# EAGLE schematic fire-fly (EAGLE 7.0.0)
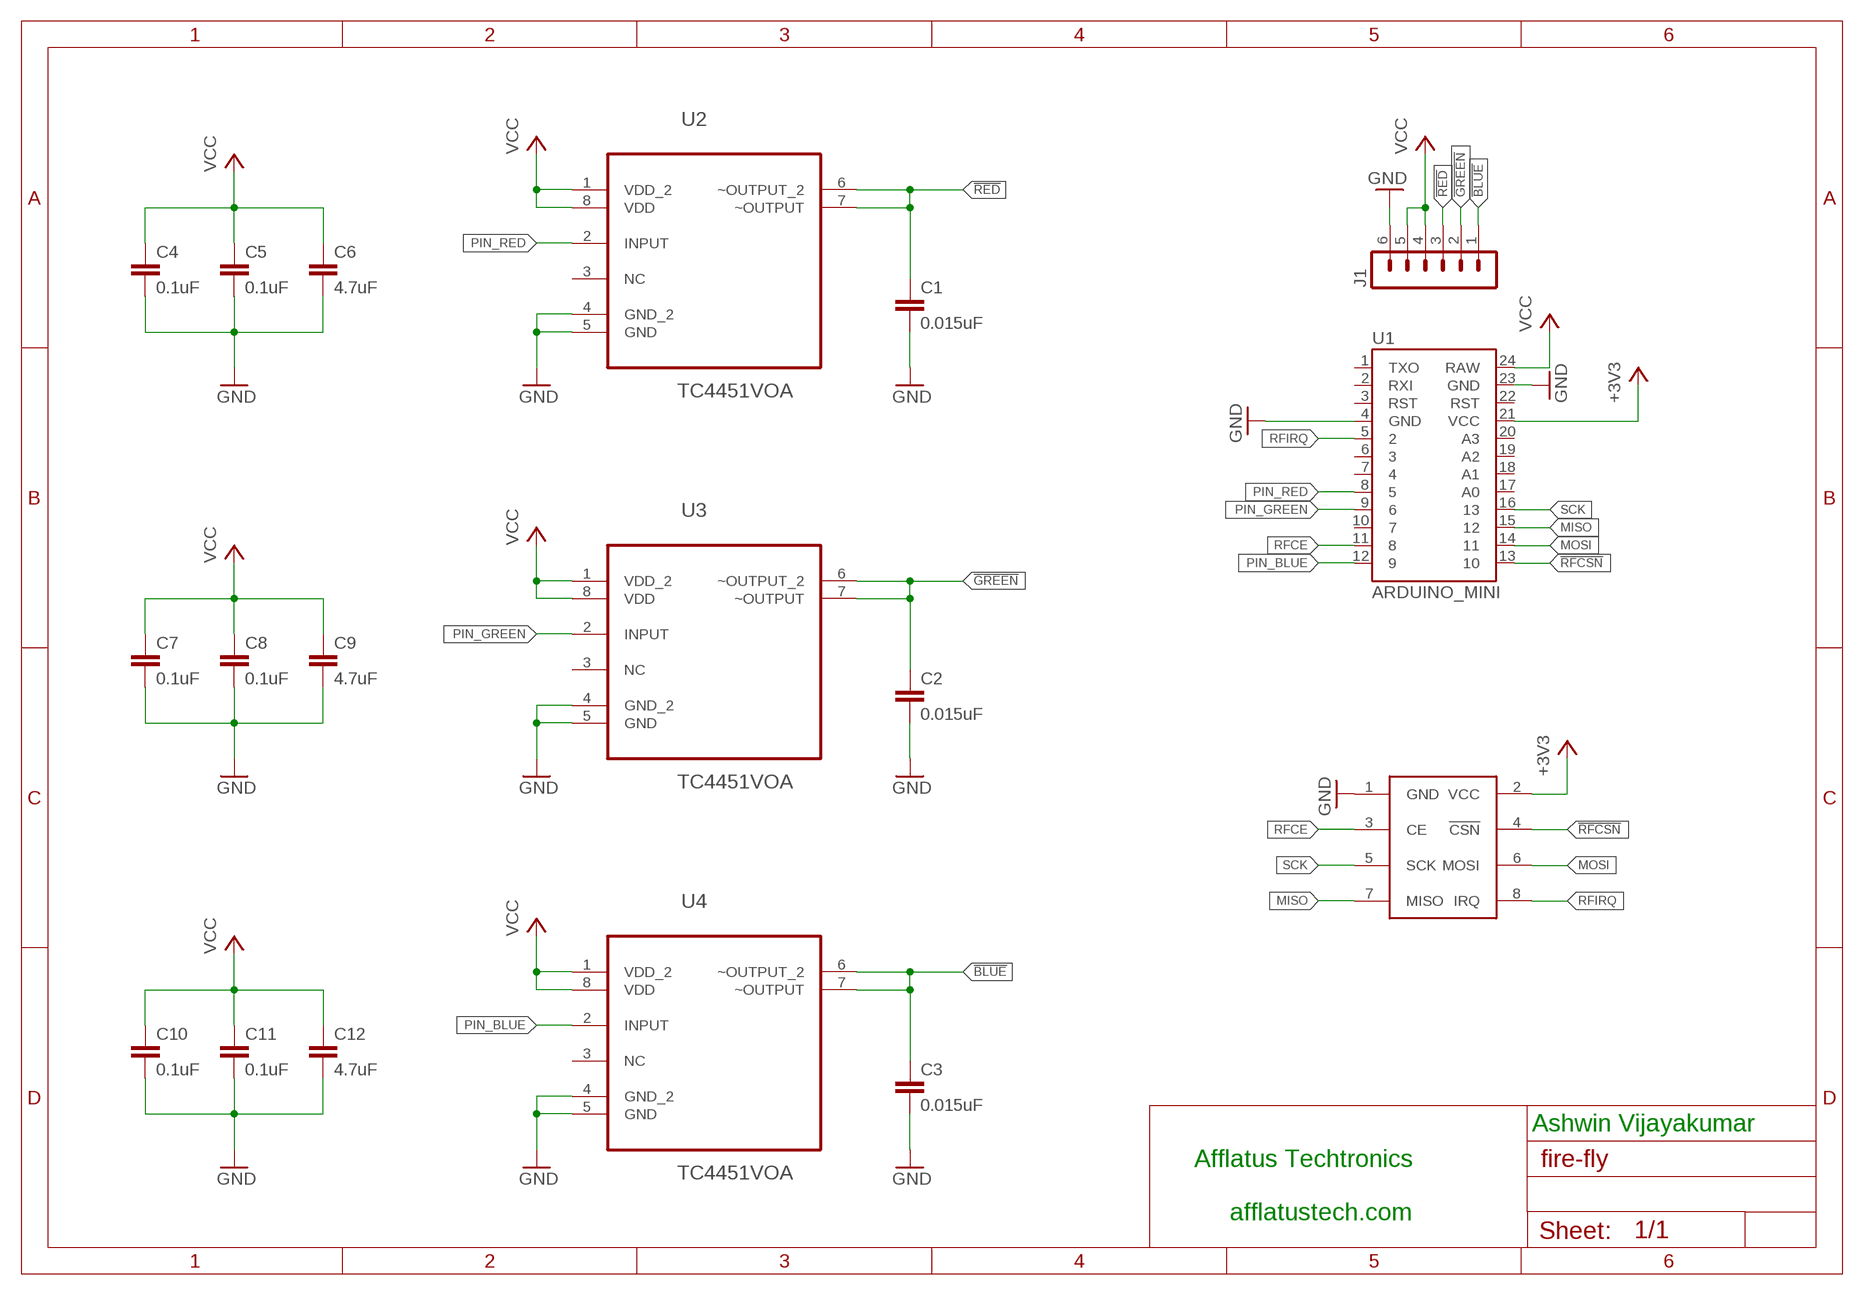
[diagram p0: schematic, sheet 1]

## Parts
C1  0.015uF  C-EUC1206  [C1206]
C2  0.015uF  C-EUC1206  [C1206]
C3  0.015uF  C-EUC1206  [C1206]
C4  0.1uF  C-EUC1206  [C1206]
C5  0.1uF  C-EUC1206  [C1206]
C6  4.7uF  C-EUC1206  [C1206]
C7  0.1uF  C-EUC1206  [C1206]
C8  0.1uF  C-EUC1206  [C1206]
C9  4.7uF  C-EUC1206  [C1206]
C10  0.1uF  C-EUC1206  [C1206]
C11  0.1uF  C-EUC1206  [C1206]
C12  4.7uF  C-EUC1206  [C1206]
J1  MA06-1  [MA06-1]
U1  ARDUINO_MINI  [ARDUINO_MINI]
U2  TC4451VOA  [SOIC127P600X175-8N]
U3  TC4451VOA  [SOIC127P600X175-8N]
U4  TC4451VOA  [SOIC127P600X175-8N]
U$1  NRF24L01_MODULE  [NRF24L01_MODULE]

## Nets
!BLUE: C3.1 J1.1 U4.6(~OUTPUT_2) U4.7(~OUTPUT)
!GREEN: C2.1 J1.2 U3.6(~OUTPUT_2) U3.7(~OUTPUT)
!RED: C1.1 J1.3 U2.6(~OUTPUT_2) U2.7(~OUTPUT)
!RFCSN: U1.13 U$1.4(!CSN)
+3V3: U1.21(VCC) U$1.2(VCC)
GND: C1.2 C2.2 C3.2 C4.2 C5.2 C6.2 C7.2 C8.2 C9.2 C10.2 C11.2 C12.2 J1.6 U1.4(GND) U1.23(GND) U2.4(GND_2) U2.5(GND) U3.4(GND_2) U3.5(GND) U4.4(GND_2) U4.5(GND) U$1.1(GND)
MISO: U1.15 U$1.7(MISO)
MOSI: U1.14 U$1.6(MOSI)
PIN_BLUE: U1.12 U4.2(INPUT)
PIN_GREEN: U1.9 U3.2(INPUT)
PIN_RED: U1.8 U2.2(INPUT)
RFCE: U1.11 U$1.3(CE)
RFIRQ: U1.5 U$1.8(IRQ)
SCK: U1.16 U$1.5(SCK)
VCC: C4.1 C5.1 C6.1 C7.1 C8.1 C9.1 C10.1 C11.1 C12.1 J1.4 J1.5 U1.24(RAW) U2.1(VDD_2) U2.8(VDD) U3.1(VDD_2) U3.8(VDD) U4.1(VDD_2) U4.8(VDD)
Unconnected: U1.1(TXO) U1.2(RXI) U1.3(RST) U1.6 U1.7 U1.10 U1.17(A0) U1.18(A1) U1.19(A2) U1.20(A3) U1.22(RST) U2.3(NC) U3.3(NC) U4.3(NC)

## Notes on the sheet
- Ashwin Vijayakumar
- Afflatus Techtronics
- afflatustech.com

## Library data of the parts
C1-C12 = rcl:C-EU: CAPACITOR, European symbol
J1 = con-lstb:MA06-1: PIN HEADER; OC_FARNELL: unknown; OC_NEWARK: unknown
U1 = SparkFun-Boards:ARDUINO_MINI: Arduino Pro Mini footprint
U2-U4 = Microchip_By_element14_Batch_1:TC4451VOA: 12A High-Speed MOSFET Drivers; MPN: TC4451VOA; OC_FARNELL: 1557419; OC_NEWARK: 56K7432; PACKAGE: SOIC-8; SUPPLIER: Microchip
U$1 = afflatustech:NRF24L01_MODULE